# EAGLE schematic ASTRA_Mk2_v4 (EAGLE 9.7.0)
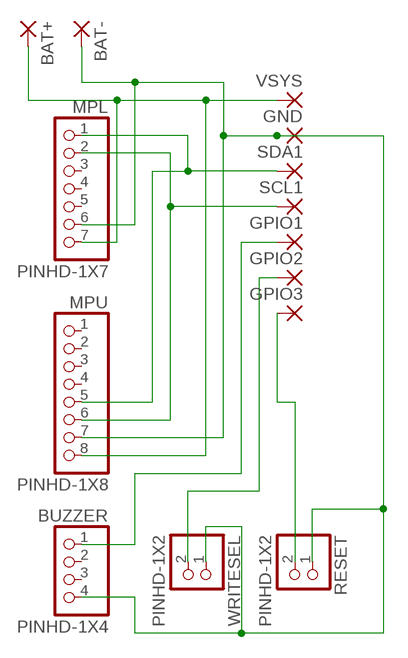
[diagram p0: schematic, sheet 1]

## Parts
BAT+  2,54/1,0  [2,54/1,0]
BAT-  2,54/1,0  [2,54/1,0]
BUZZER  PINHD-1X4  [1X04]
GND  2,54/1,0  [2,54/1,0]
GPIO1  2,54/1,0  [2,54/1,0]
GPIO2  2,54/1,0  [2,54/1,0]
GPIO3  2,54/1,0  [2,54/1,0]
MPL  PINHD-1X7  [1X07]
MPU  PINHD-1X8  [1X08]
RESET  PINHD-1X2  [1X02]
SCL1  2,54/1,0  [2,54/1,0]
SDA1  2,54/1,0  [2,54/1,0]
VSYS  2,54/1,0  [2,54/1,0]
WRITESEL  PINHD-1X2  [1X02]

## Nets
N$1: BAT+.1(P) MPL.7 MPU.8 VSYS.1(P)
N$2: BAT-.1(P) BUZZER.4 GND.1(P) MPL.6 MPU.7 RESET.1 WRITESEL.1
N$3: MPL.1 MPU.5 SDA1.1(P)
N$4: MPL.2 MPU.6 SCL1.1(P)
N$5: BUZZER.1 GPIO1.1(P)
N$6: GPIO2.1(P) WRITESEL.2
N$7: GPIO3.1(P) RESET.2
Unconnected: BUZZER.2 BUZZER.3 MPL.3 MPL.4 MPL.5 MPU.1 MPU.2 MPU.3 MPU.4

## Library data of the parts
BAT+ BAT- GND GPIO1-GPIO3 SCL1 SDA1 VSYS = wirepad:2,54/1,0: THROUGH-HOLE PAD
BUZZER = Connector:PINHD-1X4: PIN HEADER; CATEGORY: CONNECTOR; SUB-CATEGORY: PIN-HEADER
MPL = Connector:PINHD-1X7: PIN HEADER; CATEGORY: CONNECTOR; SUB-CATEGORY: PIN-HEADER
MPU = Connector:PINHD-1X8: PIN HEADER; CATEGORY: CONNECTOR; SUB-CATEGORY: PIN-HEADER
RESET WRITESEL = Connector:PINHD-1X2: PIN HEADER; CATEGORY: CONNECTOR; SUB-CATEGORY: PIN-HEADER